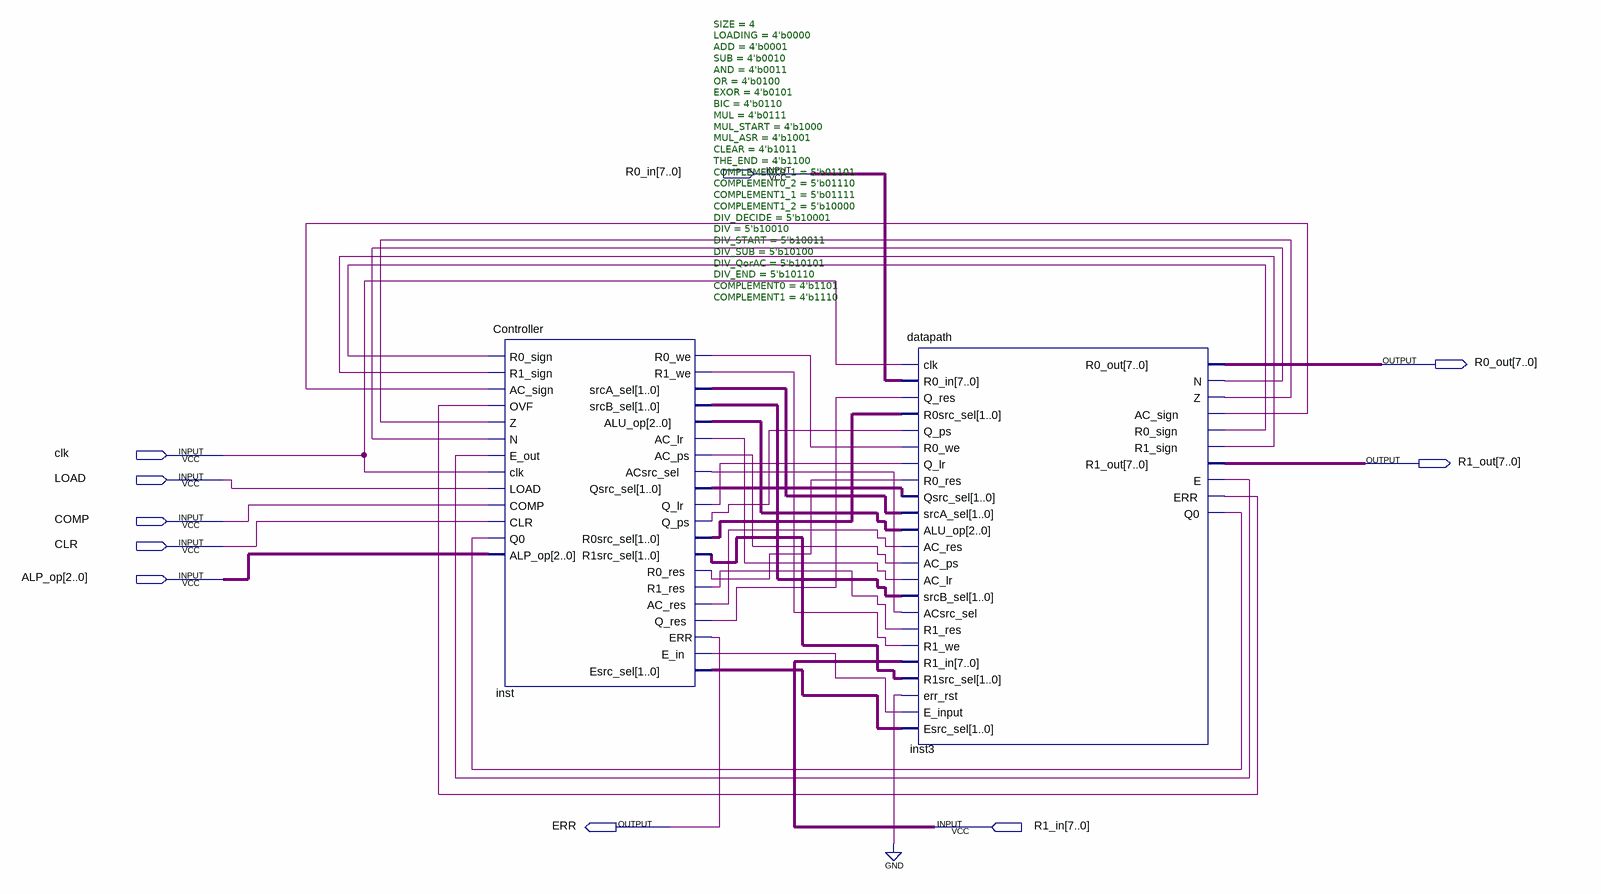
[diagram p0: schematic sheet]
// Quartus schematic lab2.bdf as structural Verilog: 2 symbols, 10 pins
module lab2 (
  input  [7:0] R0_in,
  input  clk,
  input  LOAD,
  input  COMP,
  input  CLR,
  input  [2:0] ALP_op,
  input  [7:0] R1_in,
  output [7:0] R0_out,
  output [7:0] R1_out,
  output ERR
);

  wire inst3_ac_sign, inst3_e, inst3_err, inst3_n, inst3_q0, inst3_r0_sign, inst3_r1_sign, inst3_z,
       inst_ac_lr, inst_ac_ps, inst_ac_res, inst_acsrc_sel, inst_e_in, inst_q_lr, inst_q_ps, inst_q_res,
       inst_r0_res, inst_r0_we, inst_r1_res, inst_r1_we;
  wire [1:0] inst_esrc_sel, inst_qsrc_sel, inst_r0src_sel, inst_r1src_sel, inst_srca_sel, inst_srcb_sel;
  wire [2:0] inst_alu_op;

  Controller #(.SIZE(4), .LOADING(4'b0000), .ADD(4'b0001), .SUB(4'b0010), .AND(4'b0011), .OR(4'b0100), .EXOR(4'b0101), .BIC(4'b0110), .MUL(4'b0111), .MUL_START(4'b1000), .MUL_ASR(4'b1001), .CLEAR(4'b1011), .THE_END(4'b1100), .COMPLEMENT0_1(5'b01101), .COMPLEMENT0_2(5'b01110), .COMPLEMENT1_1(5'b01111), .COMPLEMENT1_2(5'b10000), .DIV_DECIDE(5'b10001), .DIV(5'b10010), .DIV_START(5'b10011), .DIV_SUB(5'b10100), .DIV_QorAC(5'b10101), .DIV_END(5'b10110), .COMPLEMENT0(4'b1101), .COMPLEMENT1(4'b1110)) inst (
    .R0_sign(inst3_r0_sign), .R1_sign(inst3_r1_sign), .AC_sign(inst3_ac_sign), .OVF(inst3_err), .Z(inst3_z),
    .N(inst3_n), .E_out(inst3_e), .clk(clk), .LOAD(LOAD), .COMP(COMP), .CLR(CLR), .Q0(inst3_q0),
    .ALP_op(ALP_op), .R0_we(inst_r0_we), .R1_we(inst_r1_we), .srcA_sel(inst_srca_sel),
    .srcB_sel(inst_srcb_sel), .ALU_op(inst_alu_op), .AC_lr(inst_ac_lr), .AC_ps(inst_ac_ps),
    .ACsrc_sel(inst_acsrc_sel), .Qsrc_sel(inst_qsrc_sel), .Q_lr(inst_q_lr), .Q_ps(inst_q_ps),
    .R0src_sel(inst_r0src_sel), .R1src_sel(inst_r1src_sel), .R0_res(inst_r0_res), .R1_res(inst_r1_res),
    .AC_res(inst_ac_res), .Q_res(inst_q_res), .ERR(ERR), .E_in(inst_e_in), .Esrc_sel(inst_esrc_sel));
  datapath inst3 (
    .clk(clk), .R0_in(R0_in), .Q_res(inst_q_res), .R0src_sel(inst_r0src_sel), .Q_ps(inst_q_ps),
    .R0_we(inst_r0_we), .Q_lr(inst_q_lr), .R0_res(inst_r0_res), .Qsrc_sel(inst_qsrc_sel),
    .srcA_sel(inst_srca_sel), .ALU_op(inst_alu_op), .AC_res(inst_ac_res), .AC_ps(inst_ac_ps),
    .AC_lr(inst_ac_lr), .srcB_sel(inst_srcb_sel), .ACsrc_sel(inst_acsrc_sel), .R1_res(inst_r1_res),
    .R1_we(inst_r1_we), .R1_in(R1_in), .R1src_sel(inst_r1src_sel), .err_rst(1'b0), .E_input(inst_e_in),
    .Esrc_sel(inst_esrc_sel), .R0_out(R0_out), .N(inst3_n), .Z(inst3_z), .AC_sign(inst3_ac_sign),
    .R0_sign(inst3_r0_sign), .R1_sign(inst3_r1_sign), .R1_out(R1_out), .E(inst3_e), .ERR(inst3_err),
    .Q0(inst3_q0));
endmodule
